# EAGLE design Brain1portB (EAGLE 9.4.1)

## Sheet 1 of 2
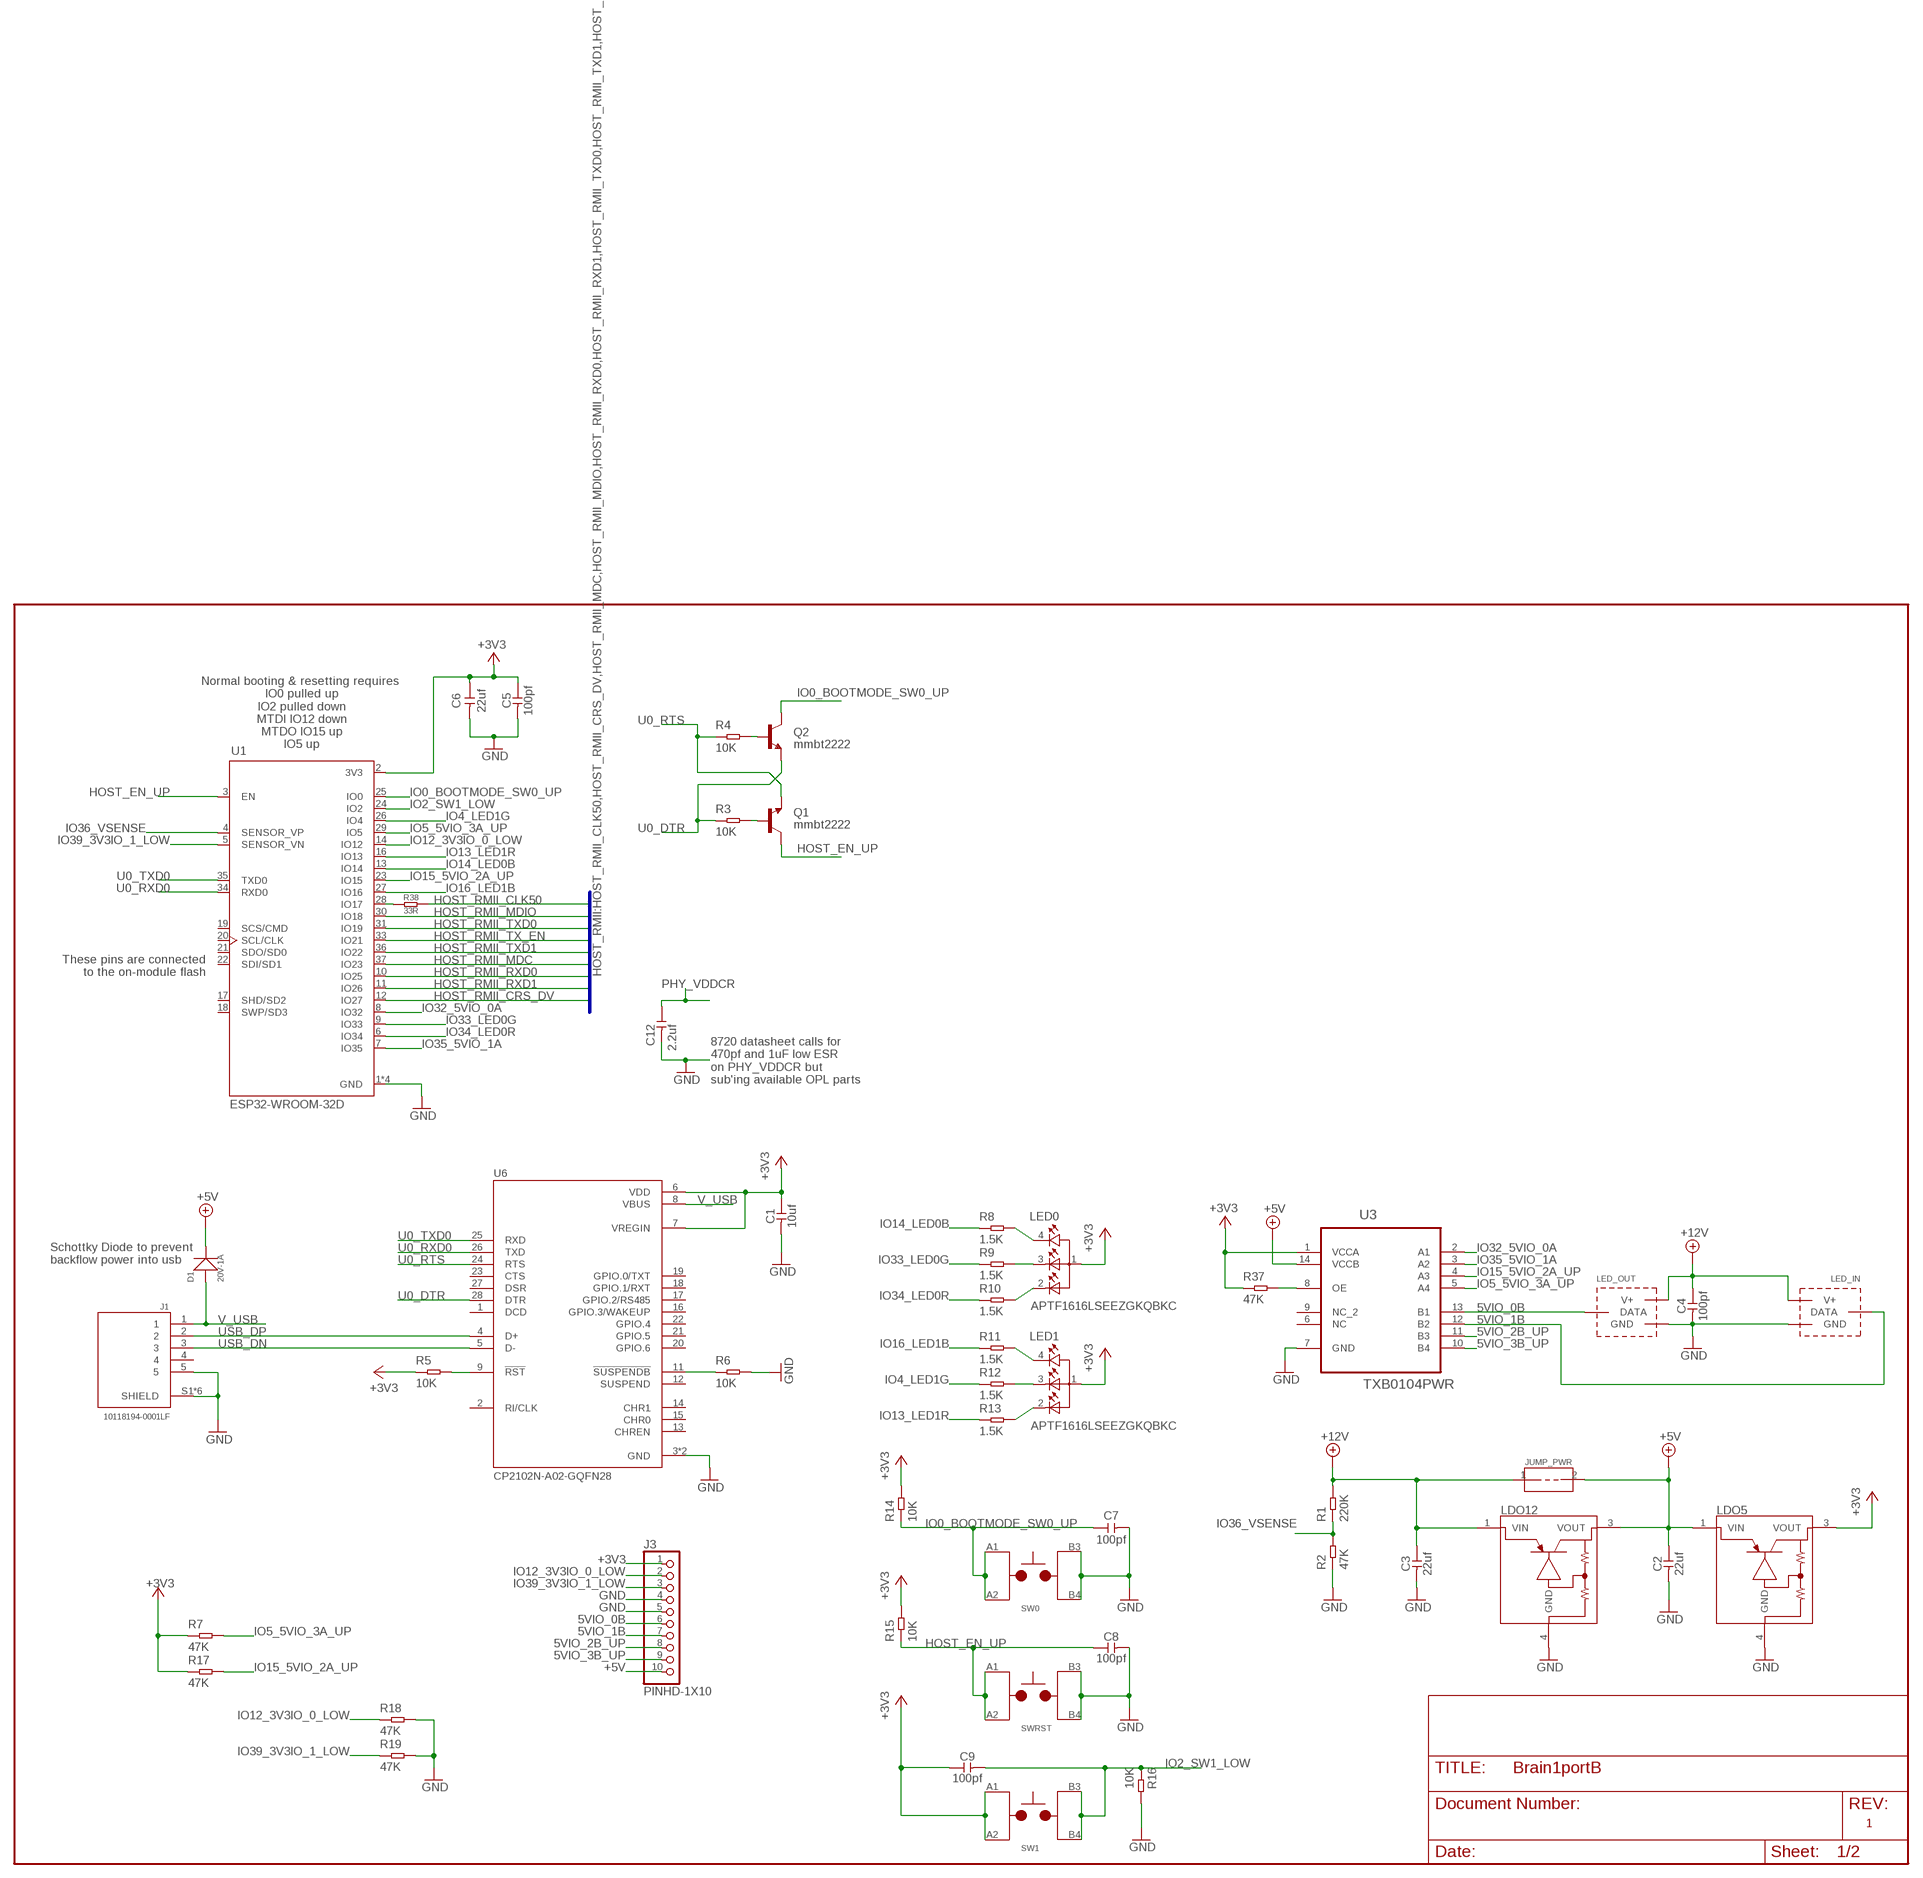
[diagram p0: schematic, sheet 1]

### Parts
C1  10uf  CERAMIC-10UF-6.3V-20%-X5R(0402)  [C0402]
C2  22uf  CERAMIC-22UF-6.3V-20%-X5R(0805)  [C0805]
C3  22uf  CERAMIC-22UF-6.3V-20%-X5R(0805)  [C0805]
C4  100pf  CERAMIC-100PF-50V-5%-NPO(0402)  [C0402]
C5  100pf  CERAMIC-100PF-50V-5%-NPO(0402)  [C0402]
C6  22uf  CERAMIC-22UF-6.3V-20%-X5R(0805)  [C0805]
C7  100pf  CERAMIC-100PF-50V-5%-NPO(0402)  [C0402]
C8  100pf  CERAMIC-100PF-50V-5%-NPO(0402)  [C0402]
C9  100pf  CERAMIC-100PF-50V-5%-NPO(0402)  [C0402]
C12  2.2uf  CERAMIC-2.2UF-10V-10%-X7R(0603)  [C0603]
D1  20V-1A  SMD-DIODE-SCHOTTKY-20V-1A(SOD-123)  [SOD-123]
J1  10118194-0001LF  [AMPHENOL_10118194-0001LF]
J3  PINHD-1X10  [1X10-BIG]
JUMP_PWR  PWR_SUPPLY_SHORT050_DRILLED  [SHORT_050_DRILLED]
LDO5  NCP5501DPAK3  [TO229P990X238-3]
LDO12  NCP5501DPAK3  [TO229P990X238-3]
LED0  APTF1616LSEEZGKQBKC  [LEDSC160X160X070-4N]
LED1  APTF1616LSEEZGKQBKC  [LEDSC160X160X070-4N]
LED_IN  3WAY_LED_CONWIRES  [3WAY_LED_WIRES]
LED_OUT  3WAY_LED_CONWIRES  [3WAY_LED_WIRES]
Q1  mmbt2222  MMBT2222ALT1-NPN-SOT23-BEC  [SOT23-BEC]
Q2  mmbt2222  MMBT2222ALT1-NPN-SOT23-BEC  [SOT23-BEC]
R1  220K  SMD-RES-220K-5%-1/16W(0402)  [R0402]
R2  47K  SMD-RES-47K-5%-1/16W(0402)  [R0402]
R3  10K  SMD-RES-10K-5%-1/(0402)  [R0402]
R4  10K  SMD-RES-10K-5%-1/(0402)  [R0402]
R5  10K  SMD-RES-10K-5%-1/(0402)  [R0402]
R6  10K  SMD-RES-10K-5%-1/(0402)  [R0402]
R7  47K  SMD-RES-47K-5%-1/16W(0402)  [R0402]
R8  1.5K  SMD-RES-1.5K-5%-1/16W(0402)  [R0402]
R9  1.5K  SMD-RES-1.5K-5%-1/16W(0402)  [R0402]
R10  1.5K  SMD-RES-1.5K-5%-1/16W(0402)  [R0402]
R11  1.5K  SMD-RES-1.5K-5%-1/16W(0402)  [R0402]
R12  1.5K  SMD-RES-1.5K-5%-1/16W(0402)  [R0402]
R13  1.5K  SMD-RES-1.5K-5%-1/16W(0402)  [R0402]
R14  10K  SMD-RES-10K-5%-1/(0402)  [R0402]
R15  10K  SMD-RES-10K-5%-1/(0402)  [R0402]
R16  10K  SMD-RES-10K-5%-1/(0402)  [R0402]
R17  47K  SMD-RES-47K-5%-1/16W(0402)  [R0402]
R18  47K  SMD-RES-47K-5%-1/16W(0402)  [R0402]
R19  47K  SMD-RES-47K-5%-1/16W(0402)  [R0402]
R37  47K  SMD-RES-47K-5%-1/16W(0402)  [R0402]
R38  33R  SMD-RES-33R-5%-1/10W(0603)  [R0603]
SW0  TL3301T3301SWITCH  [SW-4]
SW1  TL3301T3301SWITCH  [SW-4]
SWRST  TL3301T3301SWITCH  [SW-4]
U1  ESP32-WROOM-32D  [MODULE_ESP32-WROOM-32D]
U3  TXB0104PWR  [SOP65P640X120-14N]
U6  CP2102N-A02-GQFN28  CP2102N-A01-GQFN28  [QFN50P500X500X80-29N]

### Nets
5VIO_0B: J3.6 LED_OUT.DATA U3.13(B1)
5VIO_1B: J3.7 LED_IN.DATA U3.12(B2)
5VIO_2B_UP: J3.8 U3.11(B3)
5VIO_3B_UP: J3.9 U3.10(B4)
+3V3: C1.1 C5.1 C6.1 C9.1 J3.1 LDO5.3(VOUT) LED0.1 LED1.1 R5.1 R7.1 R14.2 R15.2 R17.1 R37.1 SW1.A1 SW1.A2 U1.2(3V3) U3.1(VCCA) U6.6(VDD) U6.7(VREGIN) ; also sheet 2
+5V [power]: C2.1 D1.- J3.10 JUMP_PWR.2 LDO5.1(VIN) LDO12.3(VOUT) U3.14(VCCB)
+12V [power]: C3.1 C4.1 JUMP_PWR.1 LDO12.1(VIN) LED_IN.V+ LED_OUT.V+ R1.2
GND [power]: C1.2 C2.2 C3.2 C4.2 C5.2 C6.2 C7.2 C8.2 C12.2 J1.5 J1.S1(SHIELD) J1.S2(SHIELD) J1.S3(SHIELD) J1.S4(SHIELD) J1.S5(SHIELD) J1.S6(SHIELD) J3.4 J3.5 LDO5.4(GND) LDO12.4(GND) LED_IN.GND LED_OUT.GND R2.1 R6.2 R16.2 R18.2 R19.2 SW0.B3 SW0.B4 SWRST.B3 SWRST.B4 U1.1(GND) U1.15(GND) U1.38(GND) U1.39(GND) U3.7(GND) U6.3(GND) U6.29(GND) ; also sheet 2
HOST_EN_UP: C8.1 Q1.C R15.1 SWRST.A1 SWRST.A2 U1.3(EN)
HOST_RMII_CLK50 [Ethernet]: R38.2 ; also sheet 2
HOST_RMII_CRS_DV [Ethernet]: U1.12(IO27) ; also sheet 2
HOST_RMII_MDC [Serial]: U1.37(IO23) ; also sheet 2
HOST_RMII_MDIO [Serial]: U1.30(IO18) ; also sheet 2
HOST_RMII_RXD0 [Ethernet]: U1.10(IO25) ; also sheet 2
HOST_RMII_RXD1 [Ethernet]: U1.11(IO26) ; also sheet 2
HOST_RMII_TX_EN [Ethernet]: U1.33(IO21) ; also sheet 2
HOST_RMII_TXD0 [Ethernet]: U1.31(IO19) ; also sheet 2
HOST_RMII_TXD1 [Ethernet]: U1.36(IO22) ; also sheet 2
IO0_BOOTMODE_SW0_UP: C7.1 Q2.C R14.1 SW0.A1 SW0.A2 U1.25(IO0)
IO2_SW1_LOW: C9.2 R16.1 SW1.B3 SW1.B4 U1.24(IO2)
IO4_LED1G: R12.1 U1.26(IO4)
IO5_5VIO_3A_UP: R7.2 U1.29(IO5) U3.5(A4)
IO12_3V3IO_0_LOW: J3.2 R18.1 U1.14(IO12)
IO13_LED1R: R13.1 U1.16(IO13)
IO14_LED0B: R8.1 U1.13(IO14)
IO15_5VIO_2A_UP: R17.2 U1.23(IO15) U3.4(A3)
IO16_LED1B: R11.1 U1.27(IO16)
IO32_5VIO_0A: U1.8(IO32) U3.2(A1)
IO33_LED0G: R9.1 U1.9(IO33)
IO34_LED0R: R10.1 U1.6(IO34)
IO35_5VIO_1A: U1.7(IO35) U3.3(A2)
IO36_VSENSE: R1.1 R2.2 U1.4(SENSOR_VP)
IO39_3V3IO_1_LOW: J3.3 R19.1 U1.5(SENSOR_VN)
N$1: R38.1 U1.28(IO17)
N$5: R5.2 U6.9(!RST)
N$6: R6.1 U6.11(!SUSPENDB)
N$7: Q1.B R3.2
N$8: Q2.B R4.2
N$9: LED0.4 R8.2
N$10: LED0.3 R9.2
N$11: LED0.2 R10.2
N$14: LED1.4 R11.2
N$15: LED1.3 R12.2
N$16: LED1.2 R13.2
N$27: R37.2 U3.8(OE)
PHY_VDDCR: C12.1 ; also sheet 2
U0_DTR: Q2.E R3.1 U6.28(DTR)
U0_RTS: Q1.E R4.1 U6.24(RTS)
U0_RXD0 [Serial]: U1.34(RXD0) U6.26(TXD)
U0_TXD0 [Serial]: U1.35(TXD0) U6.25(RXD)
USB_DN [Serial]: J1.3 U6.5(D-)
USB_DP [Serial]: J1.2 U6.4(D+)
V_USB [power]: D1.+ J1.1 U6.8(VBUS)
Unconnected: J1.4 U1.17(SHD/SD2) U1.18(SWP/SD3) U1.19(SCS/CMD) U1.20(SCL/CLK) U1.21(SDO/SD0) U1.22(SDI/SD1) U3.6(NC) U3.9(NC_2) U6.1(DCD) U6.2(RI/CLK) U6.12(SUSPEND) U6.13(CHREN) U6.14(CHR1) U6.15(CHR0) U6.16(GPIO.3/WAKEUP) U6.17(GPIO.2/RS485) U6.18(GPIO.1/RXT) U6.19(GPIO.0/TXT) U6.20(GPIO.6) U6.21(GPIO.5) U6.22(GPIO.4) U6.23(CTS) U6.27(DSR)

### Buses
HOST_RMII:HOST_RMII_CLK50,HOST_RMII_CRS_DV,HOST_RMII_MDC,HOST_RMII_MDIO,HOST_RMII_RXD0,HOST_RMII_RXD1,HOST_RMII_TXD0,HOST_RMII_TXD1,HOST_RMII_TX_EN

### Notes on the sheet
- Normal booting & resetting requires 
  IO0 pulled up
  IO2 pulled down
  MTDI IO12 down
  MTDO IO15 up
  IO5 up
- These pins are connected
  to the on-module flash
- 8720 datasheet calls for 
  470pf and 1uF low ESR 
  on PHY_VDDCR but
  sub'ing available OPL parts
- Schottky Diode to prevent
  backflow power into usb
- 1

## Sheet 2 of 2
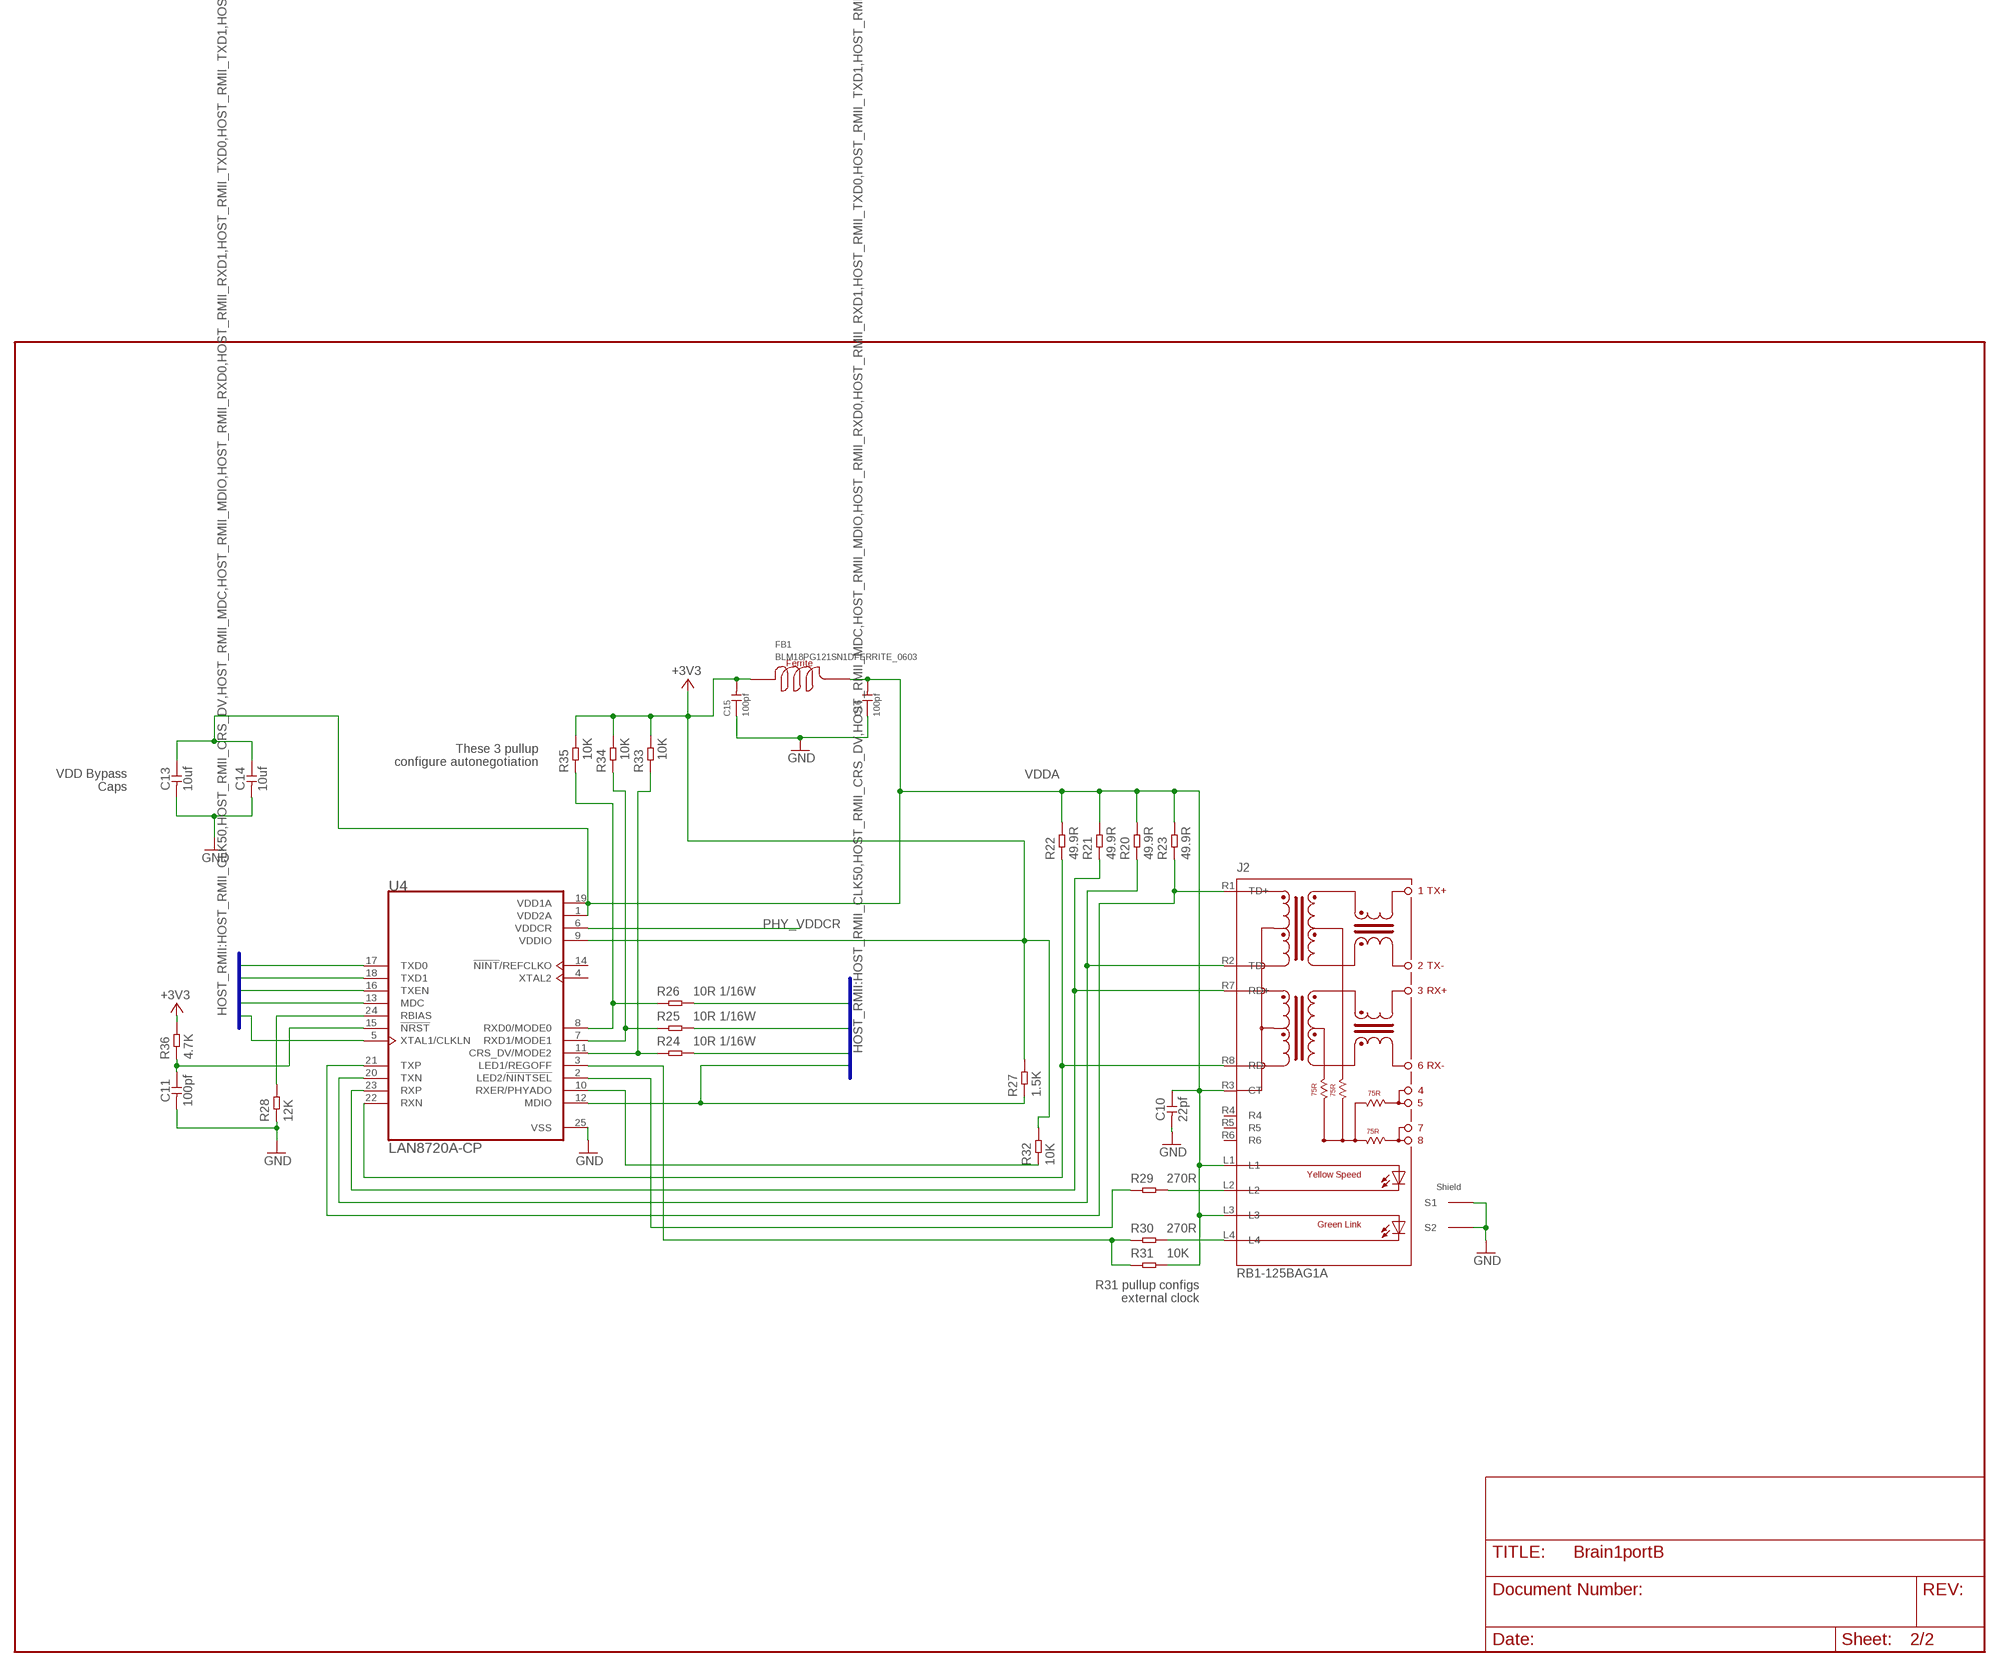
[diagram p1: schematic, sheet 2]

### Parts
C10  22pf  CERAMIC-22PF-50V-5%-NPO(0402)  [C0402]
C11  100pf  CERAMIC-100PF-50V-5%-NPO(0402)  [C0402]
C13  10uf  CERAMIC-10UF-6.3V-20%-X5R(0402)  [C0402]
C14  10uf  CERAMIC-10UF-6.3V-20%-X5R(0402)  [C0402]
C15  100pf  CERAMIC-100PF-50V-5%-NPO(0402)  [C0402]
C16  100pf  CERAMIC-100PF-50V-5%-NPO(0402)  [C0402]
FB1  BLM18PG121SN1DFERRITE_0603  [L0603]
J2  RB1-125BAG1A  [WIZNET_RB1-125BAG1A]
R20  49.9R  SMD-RES-49.9R-1%-1/16W(0402)  [R0402]
R21  49.9R  SMD-RES-49.9R-1%-1/16W(0402)  [R0402]
R22  49.9R  SMD-RES-49.9R-1%-1/16W(0402)  [R0402]
R23  49.9R  SMD-RES-49.9R-1%-1/16W(0402)  [R0402]
R24  10R 1/16W  SMD-RES-10R-5%-1/16W(0402)  [R0402]
R25  10R 1/16W  SMD-RES-10R-5%-1/16W(0402)  [R0402]
R26  10R 1/16W  SMD-RES-10R-5%-1/16W(0402)  [R0402]
R27  1.5K  SMD-RES-1.5K-5%-1/16W(0402)  [R0402]
R28  12K  SMD-RES-12K-1%-1/16W(0402)  [R0402]
R29  270R  SMD-RES-270R-1%-1/16W(0402)  [R0402]
R30  270R  SMD-RES-270R-1%-1/16W(0402)  [R0402]
R31  10K  SMD-RES-10K-5%-1/(0402)  [R0402]
R32  10K  SMD-RES-10K-5%-1/(0402)  [R0402]
R33  10K  SMD-RES-10K-5%-1/(0402)  [R0402]
R34  10K  SMD-RES-10K-5%-1/(0402)  [R0402]
R35  10K  SMD-RES-10K-5%-1/(0402)  [R0402]
R36  4.7K  SMD-RES-4.7K-5%-1/16W(0402)  [R0402]
U4  LAN8720A-CP  [QFN50P400X400X100-25N]

### Nets
+3V3: C15.2 FB1.1 R27.2 R32.2 R33.2 R34.2 R35.2 R36.2 U4.9(VDDIO) ; also sheet 1
GND [power]: C10.2 C11.2 C13.2 C14.2 C15.1 C16.1 J2.S1 J2.S2 R28.1 U4.25(VSS) ; also sheet 1
HOST_RMII_CLK50 [Ethernet]: U4.5(XTAL1/CLKLN) ; also sheet 1
HOST_RMII_CRS_DV [Ethernet]: R24.2 ; also sheet 1
HOST_RMII_MDC [Serial]: U4.13(MDC) ; also sheet 1
HOST_RMII_MDIO [Serial]: R27.1 U4.12(MDIO) ; also sheet 1
HOST_RMII_RXD0 [Ethernet]: R26.2 ; also sheet 1
HOST_RMII_RXD1 [Ethernet]: R25.2 ; also sheet 1
HOST_RMII_TX_EN [Ethernet]: U4.16(TXEN) ; also sheet 1
HOST_RMII_TXD0 [Ethernet]: U4.17(TXD0) ; also sheet 1
HOST_RMII_TXD1 [Ethernet]: U4.18(TXD1) ; also sheet 1
N$12: J2.R8(RD-) R22.1 U4.22(RXN)
N$13: J2.R7(RD+) R21.1 U4.23(RXP)
N$17: J2.R2(TD-) R20.1 U4.20(TXN)
N$18: R24.1 R33.1 U4.11(CRS_DV/MODE2)
N$19: J2.R1(TD+) R23.1 U4.21(TXP)
N$20: R25.1 R34.1 U4.7(RXD1/MODE1)
N$21: R26.1 R35.1 U4.8(RXD0/MODE0)
N$22: R28.2 U4.24(RBIAS)
N$23: R30.1 R31.1 U4.3(LED1/REGOFF)
N$24: R29.1 U4.2(LED2/!NINTSEL!)
N$25: J2.L2 R29.2
N$26: J2.L4 R30.2
N$28: C11.1 R36.1 U4.15(!NRST)
N$29: R32.1 U4.10(RXER/PHYADO)
PHY_VDDCR: U4.6(VDDCR) ; also sheet 1
VDDA: C10.1 C13.1 C14.1 C16.2 FB1.2 J2.L1 J2.L3 J2.R3(CT) R20.2 R21.2 R22.2 R23.2 R31.2 U4.1(VDD2A) U4.19(VDD1A)
Unconnected: J2.R4 J2.R5 J2.R6 U4.4(XTAL2) U4.14(!NINT!/REFCLKO)

### Buses
HOST_RMII:HOST_RMII_CLK50,HOST_RMII_CRS_DV,HOST_RMII_MDC,HOST_RMII_MDIO,HOST_RMII_RXD0,HOST_RMII_RXD1,HOST_RMII_TXD0,HOST_RMII_TXD1,HOST_RMII_TX_EN

### Notes on the sheet
- These 3 pullup
  configure autonegotiation
- VDD Bypass
  Caps
- R31 pullup configs
  external clock

## Library data of the parts
C1 C13 C14 = OPL_Capacitor:CERAMIC-10UF-6.3V-20%-X5R(0402): 302010053; MPN: CC0402MRX5R5BB106
C2 C3 C6 = OPL_Capacitor:CERAMIC-22UF-6.3V-20%-X5R(0805): 302010171; MPN: CC0805MKX5R5BB226
C4 C5 C7-C9 C11 C15 C16 = OPL_Capacitor:CERAMIC-100PF-50V-5%-NPO(0402): 302010012; MPN: CC0402JRNPO9BN101
C10 = OPL_Capacitor:CERAMIC-22PF-50V-5%-NPO(0402): 302010018; MPN: CC0402JRNPO9BN220
C12 = OPL_Capacitor:CERAMIC-2.2UF-10V-10%-X7R(0603): 302010054; MPN: CC0603KRX7R6BB225
D1 = OPL_Discrete_Semiconductor:SMD-DIODE-SCHOTTKY-20V-1A(SOD-123): 304020034; MPN: B5819W
FB1 = TomSeago:BLM18PG121SN1D
J1 = 10118194-0001LF:10118194-0001LF: Micro Usb, 2.0 Type b, Rcpt, Smt; DESCRIPTION: Micro Usb, 2.0 Type b, Rcpt, Smt; DIGI-KEY_PART_NUMBER: 609-4618-1-ND; DIGI-KEY_PURCHASE_URL: https://www.digikey.com/product-detail/en/amphenol-icc-fci/10118194-0001LF/609-4618-1-ND/2785382?utm_source=snapeda&utm_medium=aggregator&utm_campaign=symbol; MF: Amphenol ICC; MP: 10118194-0001LF; PACKAGE: None
J2 = TomSeago:RB1-125BAG1A: Wiznet RB1-125BAG1A RJ45 1x1 Tab Down Through Hole
J3 = adafruit:PINHD-1X10: Pin header 1x10 0.1" spacing With round pins
JUMP_PWR = TomSeago:PWR_SUPPLY_SHORT
LDO5 LDO12 = TomSeago:NCP5501
LED0 LED1 = APTF1616LSEEZGKQBKC:APTF1616LSEEZGKQBKC: HELI Colour; 1.6X1.6MM LOW CURRENT RGB SMD LED; AVAILABILITY: Unavailable; DESCRIPTION: HELI Colour; 1.6X1.6MM LOW CURRENT RGB SMD LED; MF: Kingbright; MP: APTF1616LSEEZGKQBKC; PACKAGE: 0606 Kingbright; PRICE: None
LED_IN LED_OUT = TomSeago:3WAY_LED_CON
Q1 Q2 = transistor:*-NPN-: NPN Transistror BF959 corrected 2008.03.06
R1 = OPL_Resistor:SMD-RES-220K-5%-1/16W(0402): 301012019; MPN: RC0402JR-070RL; VALUE: 0R
R2 R7 R17-R19 R37 = OPL_Resistor:SMD-RES-47K-5%-1/16W(0402): 301010005; MPN: RC0402JR-0747KL
R3-R6 R14-R16 R31-R35 = OPL_Resistor:SMD-RES-10K-5%-1/(0402): 301010004; MPN: RC0402JR-0710KL
R8-R13 R27 = OPL_Resistor:SMD-RES-1.5K-5%-1/16W(0402): 301012015; MPN: RC0402JR-071K5L
R20-R23 = OPL_Resistor:SMD-RES-49.9R-1%-1/16W(0402): 301012002; MPN: RC0402FR-0749R9L
R24-R26 = OPL_Resistor:SMD-RES-10R-5%-1/16W(0402): 301010075; MPN: RC0402JR-0710RL
R28 = OPL_Resistor:SMD-RES-12K-1%-1/16W(0402): 301011982; MPN: RC0402JR-070RL; VALUE: 0R
R29 R30 = OPL_Resistor:SMD-RES-270R-1%-1/16W(0402): 301011992; MPN: RC0402JR-070RL; VALUE: 0R
R36 = OPL_Resistor:SMD-RES-4.7K-5%-1/16W(0402): 301012026; MPN: RC0402JR-074K7L
R38 = OPL_Resistor:SMD-RES-33R-5%-1/10W(0603): 301012124; MPN: RC0603FR-071K5L; VALUE: 1.5K
SW0 SW1 SWRST = TomSeago:TL3301
U1 = ESP32-WROOM-32D:ESP32-WROOM-32D: IC: SoC; GPIO, I2C, I2S, IR, SD, SDIO, SPI, UART; 2.7÷3.6VDC; 20dBm; DESCRIPTION: IC: SoC; GPIO, I2C, I2S, IR, SD, SDIO, SPI, UART; 2.7÷3.6VDC; 20dBm; DIGI-KEY_PART_NUMBER: 1904-1023-1-ND; DIGI-KEY_PURCHASE_URL: https://www.digikey.com/product-detail/en/espressif-systems/ESP32-WROOM-32D/1904-1023-1-ND/9381732?utm_source=snapeda&utm_medium=aggregator&utm_campaign=symbol; MF: Espressif Systems; MP: ESP32-WROOM-32D; PACKAGE: Module Espressif Systems
U3 = TXB0104PWR:TXB0104PWR: 4-BIT BIDIRECTIONAL VOLTAGE-LEVEL TRANSLATOR; AVAILABILITY: Unavailable; DESCRIPTION: 4-Bit Bidirectional Voltage-Level Shifter with Auto Direction Sensing and +/-15 kV ESD Protect 14-TSSOP -40 to 85; MF: Texas Instruments; MP: TXB0104PWR; PACKAGE: TSSOP-14 Texas Instruments; PRICE: None
U4 = LAN8720A-CP:LAN8720A-CP: LAN8720A Series 3.3 V RMII 10/100 Ethernet Transceiver Surface Mount - QFN-24; DESCRIPTION: LAN8720A Series 3.3 V RMII 10/100 Ethernet Transceiver Surface Mount - QFN-24; DIGI-KEY_PART_NUMBER: 638-1080-ND; DIGI-KEY_PURCHASE_URL: https://www.digikey.com/product-detail/en/microchip-technology/LAN8720A-CP/638-1080-ND/2051556?utm_source=snapeda&utm_medium=aggregator&utm_campaign=symbol; MF: Microchip; MP: LAN8720A-CP; PACKAGE: QFN-24 Microchip
U6 = CP2102N-A01-GQFN28:CP2102N-A01-GQFN28: Ic Bridge Usb To Uart 28qfn; AVAILABILITY: Unavailable; DESCRIPTION: Usb-Uart Interface Bridge, Qfn-28; MF: Silicon Labs; MP: CP2102N-A01-GQFN28; PACKAGE: QFN-28 Silicon Labs; PRICE: None

## Net classes
0 default: width 0.203 mm, clearance 0.203 mm
1 power: width 0.406 mm, clearance 0.203 mm
2 Ethernet: width 0.203 mm, clearance 0.203 mm
3 Serial: width 0.203 mm, clearance 0.203 mm

## Board
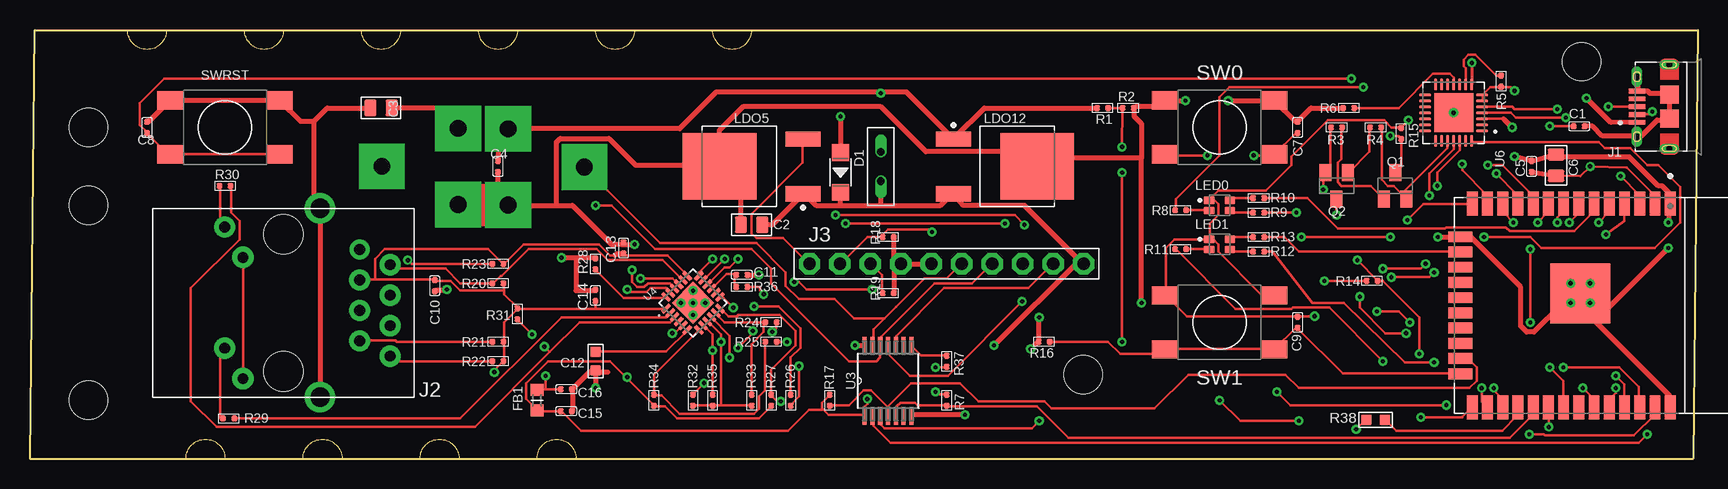
[diagram p2: board, top side]
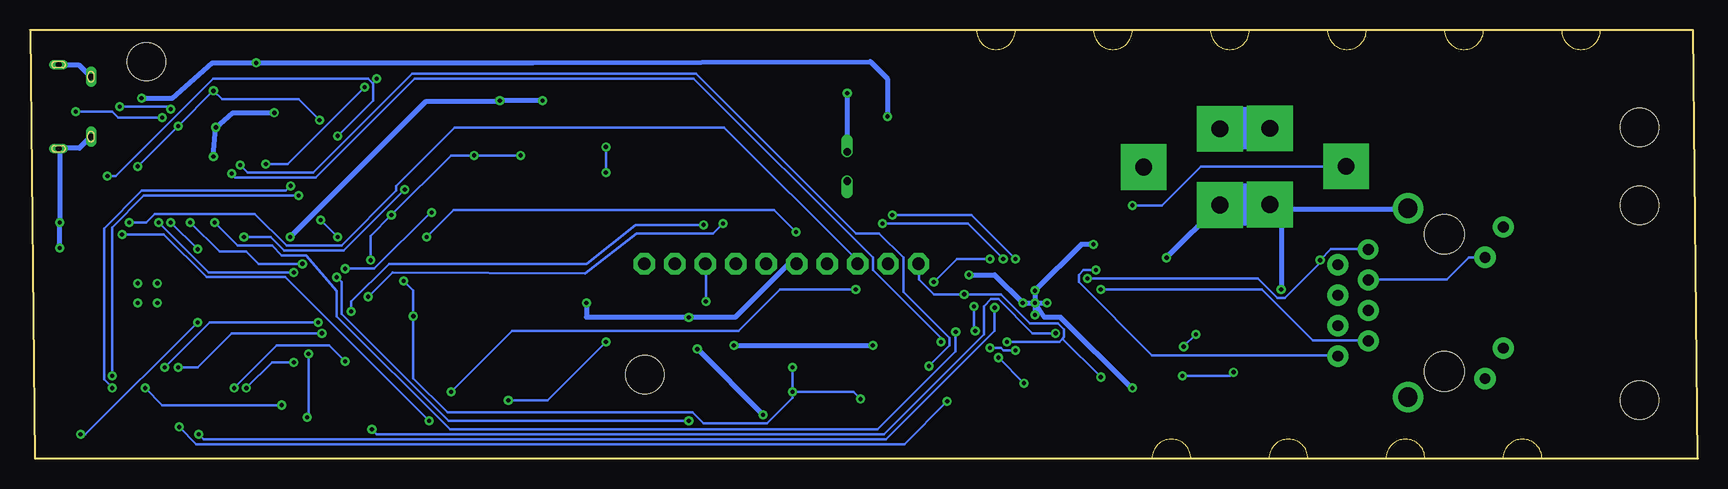
[diagram p3: board, bottom side, seen from below]

Size 139.04 x 35.76 mm. Coordinates in mm from the lower left corner, seen from the top.
Outline: 0,0 0.41,35.76 139.04,35.76 138.63,0 0,0
Copper layers (1*16): Top 0.035mm / dielectric 1.5mm / Bottom 0.035mm
Design rules "default *": minimum track width 8mil, minimum drill 0.35mm, track to track 6mil, track to pad 6mil, pad to pad 6mil, via to via 6mil, smd to smd 6mil, copper to edge 40mil, drill to drill 18mil, minimum pad ring 6mil, minimum via ring 8mil, stop-mask expansion 4mil, vias tented up to drill 0mil, thermal gap 10mil
Holes 3.17 mm at 4.88,4.88 4.88,21.13 129.34,33.12 4.88,27.64 87.78,7.01
tRestrict: area 0,0 to 8.9,22.9
Milling: 10 lines

### Footprints (pad centres in the part's own frame; a part is rotated, then mirrored left to right if it is on the bottom)
C0402 = smd 0.5 x 0.5: 1 0,0.463; 2 0,-0.463
C0805 = smd 1.397 x 1.016: 1 0,0.889; 2 0,-0.889
C0603 = smd 0.889 x 0.889: 1 0,0.762; 2 0,-0.762
SOD-123 = smd 1.397 x 1.397: + -1.651,0; - 1.651,0
L0603 = smd 1 x 1.1: 1 -0.85,0; 2 0.85,0
AMPHENOL_10118194-0001LF = smd 0.4 x 1.35: 1 -1.3,2.7; 2 -0.65,2.7; 3 0,2.7; 4 0.65,2.7; 5 1.3,2.7 | drill 0.55 pad 0.65 long: S1 -2.5,2.7; S2 2.5,2.7 | drill 0.5 pad 0.775 long: S3 -3.5,0; S6 3.5,0 | smd 1.5 x 1.55: S4 -1,0; S5 1,0
WIZNET_RB1-125BAG1A = drill 0.9 pad 1.778: L1 6.325,-3.38; L2 3.784,-4.899; L3 -3.786,-3.379; L4 -6.325,-4.9; R2 -3.176,8.889; R3 -1.906,6.349; R4 -0.636,8.889; R5 0.634,6.349; R6 1.904,8.889; R7 3.174,6.349; R8 4.444,8.889 | drill 0.9 pad 1.7: R1 -4.446,6.349 | drill 1.6 pad 2.54: S1 -7.876,3.049; S2 7.874,3.049 | hole 3.3: 5.714,-0.001; -5.716,-0.001
1X10-BIG = drill 1.016 pad 1.778 octagon: 1 -11.43,0; 2 -8.89,0; 3 -6.35,0; 4 -3.81,0; 5 -1.27,0; 6 1.27,0; 7 3.81,0; 8 6.35,0; 9 8.89,0; 10 11.43,0
SHORT_050_DRILLED = drill 0.65 offset: 1 -1.219,0; 2 1.219,0
TO229P990X238-3 = smd 2.934 x 1.256: 1 -4.291,2.29; 3 -4.291,-2.29 | smd 6.154 x 5.567: 4 2.681,0
LEDSC160X160X070-4N = smd 0.89 x 0.64: 1 -0.87,0.425; 2 0.87,0.425; 3 0.87,-0.425; 4 -0.87,-0.425
3WAY_LED_WIRES = drill 1.4 pad 3.81 square: DATA -3.175,0; GND 3.175,-3.175; V+ 3.175,3.175
SOT23-BEC = smd 1 x 1.4: B -0.95,-1.1; C 0,1.1; E 0.95,-1.1
R0402 = smd 0.5 x 0.5: 1 0,0.463; 2 0,-0.463
R0603 = smd 0.889 x 0.889: 1 0,0.762; 2 0,-0.762
SW-4 = smd 2.212 x 1.512: A1 -4.55,-2.25; A2 4.55,-2.25; B3 -4.55,2.25; B4 4.55,2.25
MODULE_ESP32-WROOM-32D = smd 2 x 0.9: 1 -8.5,5.26; 2 -8.5,3.99; 3 -8.5,2.72; 4 -8.5,1.45; 5 -8.5,0.18; 6 -8.5,-1.09; 7 -8.5,-2.36; 8 -8.5,-3.63; 9 -8.5,-4.9; 10 -8.5,-6.17; 11 -8.5,-7.44; 12 -8.5,-8.71; 13 -8.5,-9.98; 14 -8.5,-11.25; 25 8.5,-11.25; 26 8.5,-9.98; 27 8.5,-8.71; 28 8.5,-7.44; 29 8.5,-6.17; 30 8.5,-4.9; 31 8.5,-3.63; 32 8.5,-2.36; 33 8.5,-1.09; 34 8.5,0.18; 35 8.5,1.45; 36 8.5,2.72; 37 8.5,3.99; 38 8.5,5.26 | smd 0.9 x 2: 15 -5.715,-12.25; 16 -4.445,-12.25; 17 -3.175,-12.25; 18 -1.905,-12.25; 19 -0.635,-12.25; 20 0.635,-12.25; 21 1.905,-12.25; 22 3.175,-12.25; 23 4.445,-12.25; 24 5.715,-12.25 | smd 5 x 5: 39 -1,-2.24
SOP65P640X120-14N = smd 1.473 x 0.356: 1 -2.921,1.956; 2 -2.921,1.295; 3 -2.921,0.66; 4 -2.921,0; 5 -2.921,-0.66; 6 -2.921,-1.295; 7 -2.921,-1.956; 8 2.921,-1.956; 9 2.921,-1.295; 10 2.921,-0.66; 11 2.921,0; 12 2.921,0.66; 13 2.921,1.295; 14 2.921,1.956
QFN50P400X400X100-25N = smd 0.86 x 0.26: 1 -1.935,1.25; 2 -1.935,0.75; 3 -1.935,0.25; 4 -1.935,-0.25; 5 -1.935,-0.75; 6 -1.935,-1.25; 13 1.935,-1.25; 14 1.935,-0.75; 15 1.935,-0.25; 16 1.935,0.25; 17 1.935,0.75; 18 1.935,1.25 | smd 0.26 x 0.86: 7 -1.25,-1.935; 8 -0.75,-1.935; 9 -0.25,-1.935; 10 0.25,-1.935; 11 0.75,-1.935; 12 1.25,-1.935; 19 1.25,1.935; 20 0.75,1.935; 21 0.25,1.935; 22 -0.25,1.935; 23 -0.75,1.935; 24 -1.25,1.935 | smd 2.5 x 2.5: 25 0,0
QFN50P500X500X80-29N = smd 1.01 x 0.27: 1 -2.36,1.5; 2 -2.36,1; 3 -2.36,0.5; 4 -2.36,0; 5 -2.36,-0.5; 6 -2.36,-1; 7 -2.36,-1.5; 15 2.36,-1.5; 16 2.36,-1; 17 2.36,-0.5; 18 2.36,0; 19 2.36,0.5; 20 2.36,1; 21 2.36,1.5 | smd 0.27 x 1.01: 8 -1.5,-2.36; 9 -1,-2.36; 10 -0.5,-2.36; 11 0,-2.36; 12 0.5,-2.36; 13 1,-2.36; 14 1.5,-2.36; 22 1.5,2.36; 23 1,2.36; 24 0.5,2.36; 25 0,2.36; 26 -0.5,2.36; 27 -1,2.36; 28 -1.5,2.36 | smd 3.25 x 3.25: 29 0,0

### Placement (x,y rotation side)
C1  129.13,27.74 90 top
C2  60.15,19.51 270 top
C3  29.26,29.26 270 top
C4  39.01,24.38 0 top
C5  125.17,24.38 180 top
C6  127.2,24.49 180 top
C7  105.66,27.64 180 top
C8  9.75,27.64 180 top
C9  105.66,11.38 0 top
C10  33.73,14.43 0 top
C11  59.33,15.34 90 top
C12  47.14,8.13 0 top
C13  49.48,17.58 180 top
C14  47.14,13.61 180 top
C15  44.7,3.96 270 top
C16  44.7,5.79 270 top
D1  67.56,23.88 270 top
FB1  42.27,4.88 90 top
J1  136.65,29.36 90 top
J2  21.13,13 270 top
J3  76.4,16.26 0 top
JUMP_PWR  70.92,24.38 270 top
LDO5  60.15,24.38 180 top
LDO12  81.28,24.38 0 top
LED0  99.16,21.13 0 top
LED1  99.16,17.88 0 top
LED_IN  32.51,24.38 0 top
LED_OUT  43.03,24.33 0 bottom
Q1  113.79,22.76 0 top
Q2  108.92,22.76 180 top
R1  89.41,29.26 270 top
R2  91.54,29.26 270 top
R3  108.92,27.64 90 top
R4  112.17,27.64 270 top
R5  122.63,31.5 180 top
R6  109.93,29.26 270 top
R7  76.4,4.88 0 top
R8  95.91,20.73 90 top
R9  102.41,20.52 270 top
R10  102.41,21.74 270 top
R11  95.91,17.48 90 top
R12  102.41,17.27 270 top
R13  102.41,18.49 270 top
R14  111.86,14.83 270 top
R15  114.3,27.13 180 top
R16  84.53,9.75 270 top
R17  66.65,4.88 0 top
R18  71.53,18.49 90 top
R19  71.53,13.82 90 top
R20  39.01,14.63 90 top
R21  39.01,9.75 90 top
R22  39.01,8.13 90 top
R23  39.01,16.26 90 top
R24  61.77,11.38 90 top
R25  61.77,9.75 90 top
R26  63.4,4.88 0 top
R27  61.77,4.88 0 top
R28  47.14,16.26 0 top
R29  16.56,3.35 270 top
R30  16.26,22.76 270 top
R31  40.64,12.09 180 top
R32  55.27,4.88 0 top
R33  60.15,4.88 0 top
R34  52.02,4.88 0 top
R35  56.9,4.88 0 top
R36  59.33,14.33 90 top
R37  76.4,8.13 180 top
R38  112.17,3.25 270 top
SW0  99.16,27.64 0 top
SW1  99.16,11.38 180 top
SWRST  16.26,27.64 0 top
U1  131.47,12.8 270 top
U3  71.53,6.5 90 top
U4  55.27,13 45 top
U6  118.67,28.85 180 top

### Tracks (layer width: path | path; a pad name or v marks a point on that pad's centre or on a via)
5VIO_0B
  Top 0.203: 71.22,11.68 70.31,10.77 70.31,9.45 U3.13 | J3.6 77.62,16.26 76.4,15.04 74.57,15.04 72.19,12.65 71.22,11.68 | 71.22,11.68 68.68,11.68 67.06,13.31 64.11,13.31 62.99,14.43 62.99,15.54 60.55,17.98 52.53,17.98 46.23,24.28 LED_OUT.DATA
5VIO_1B  (via drill 0.35)
  Top 0.203: J3.7 80.16,16.26 78.54,14.63 75.39,14.63 70.92,10.16 70.92,9.45 U3.12 70.87,8.43 70.56,8.13 68.28,8.13 61.77,14.63 61.77,15.85 60.15,17.48 52.12,17.48 48.46,21.13 v47.14,21.13
  Bottom 0.203: v47.14,21.13 44.7,21.13 41.45,24.38 LED_IN.DATA
5VIO_2B_UP  (via drill 0.35)
  Top 0.203: U3.11 71.53,8.74 73.36,6.91 76.5,6.91 v82.7,13.11
  Bottom 0.203: v82.7,13.11 82.7,16.26 J3.8
5VIO_3B_UP
  Top 0.203: U3.10 72.24,9.45 72.24,10.26 76.2,14.22 83.21,14.22 85.24,16.26 J3.9
+3V3  (via drill 0.35)
  Top 0.203: 56.9,4.47 55.27,4.47 R32.2 | 56.9,4.47 57.61,4.47 | 57.61,4.47 60.15,4.47 R33.2 | 56.9,4.47 R35.2 | 57.61,4.47 v57.61,9.75 57.61,10.36 56.49,11.48 U4.9 | v61.16,13.72 60.86,14.02 60.86,14.33 R36.2 | LDO5.3 64.41,26.62 64.41,24.69 60.15,20.42 60.15,18.8 60.55,18.39 62.79,18.39 64.92,16.26 J3.1 | v75.49,5.59 75.69,5.38 76.4,5.38 R7.1 | v75.49,7.62 76.4,7.62 R37.1 | 66.09,4.12 66.55,3.66 69.49,3.66 U3.1 69.6,3.66 69.6,4.37 69.8,4.57 v69.8,4.98 | 66.09,4.12 66.04,4.17 66.04,4.67 66.65,5.28 R17.1 | R27.2 61.77,4.37 60.76,3.35 53.95,3.35 52.93,4.37 52.02,4.37 R34.2 52.02,4.47 49.73,6.76 | 49.73,6.76 48.36,8.13 43.18,8.13 41.35,6.3 41.35,4.98 42.27,4.06 FB1.1 42.27,3.96 C15.2 44.3,3.96 45.92,2.34 63.2,2.34 64.92,4.06 66.04,4.06 66.09,4.12 | v49.78,6.81 49.73,6.76 | v126.69,27.74 C1.1 | U6.6 121.11,29.97 121.11,30.28 U6.7 121.11,30.38 121.72,30.99 122.63,30.99 | 114.3,27.64 113.49,27.64 112.88,28.25 108.2,28.25 105.16,25.2 105.16,24.49 103.02,22.35 99.06,22.35 98.35,21.64 LED0.1 98.55,21.74 99.06,21.23 99.06,20.32 98.35,19.61 98.35,18.39 LED1.1 | SW1.A1 103.63,13.72 102.62,13.72 99.06,17.27 99.06,17.88 98.55,18.39 98.45,18.39 LED1.1 | 114.3,27.64 v114.91,28.25 | 114.3,27.64 R15.2 | 105.66,11.89 96.42,11.89 94.69,13.61 SW1.A2 94.69,13.72 94.69,17.58 95.4,18.29 98.25,18.29 LED1.1 | R14.2 v107.9,14.83 | 105.66,11.89 v107.09,11.89 | 105.66,11.89 C9.1 | 135.43,21.23 U1.2 135.43,21.34 135.43,21.95 133.1,24.28 v130.05,24.38 129.24,23.57 C6.1 | 122.63,30.99 123.44,30.99 v123.75,30.68 | 122.63,30.99 R5.1
  Top 0.406: C5.1 C6.1
  Bottom 0.203: J3.1 64.92,16.26 64.92,14.94 63.7,13.72 v61.16,13.72 58.12,13.72 55.68,11.28 53.34,11.28 52.83,10.77 52.83,10.16 52.98,10.01 | v57.61,9.75 53.24,9.75 52.98,10.01 | v75.49,7.62 v75.49,5.59 | v75.49,5.59 70.41,5.59 v69.8,4.98 | v49.78,6.81 52.98,10.01 | v114.91,28.25 116.64,29.97 123.04,29.97 v123.75,30.68 v126.69,27.74 v130.05,24.38 | v107.9,14.83 107.09,14.02 v107.09,11.89 107.09,6.71 104.24,3.86 83.82,3.86 82.91,2.95 77.62,2.95 75.49,5.08 v75.49,5.59
+5V  (via drill 0.35)
  Top 0.406: C2.1 61.87,19.51 64.41,22.05 LDO5.1 64.62,22.05 65.53,21.13 67.56,21.13 | 67.56,21.13 70.92,21.13 | 70.92,21.13 75.89,21.13 76.81,22.05 76.91,22.05 LDO12.3 77.8,21.13 82.91,21.13 87.78,16.26 J3.10 87.38,16.46 v80.37,9.45 | v68.78,9.45 69.49,9.45 U3.14 | 67.56,21.13 D1.- | 70.92,21.13 JUMP_PWR.2
  Bottom 0.406: v80.37,9.45 v68.78,9.45
+12V  (via drill 0.35)
  Top 0.406: C4.1 39.01,26.62 39.83,27.43 LED_OUT.V+ 40.03,27.53 54.15,27.53 57.2,30.58 70.92,30.58 | C3.1 34.04,29.26 35.66,27.64 LED_IN.V+ | 70.92,30.58 73.08,30.58 LDO12.1 77.11,26.82 79.55,29.26 R1.2 | v70.92,30.48 70.92,30.58
  Bottom 0.406: v70.92,30.48 JUMP_PWR.1 | 39.8,27.56 LED_OUT.V+
  Bottom 3.556: LED_IN.V+ 39.8,27.56
GND  (via drill 0.35)
  Top 0.254: U6.3 122.83,28.35
  Top 0.406: 23.67,28.14 22.55,28.14 20.83,29.87 SWRST.B4 20.62,29.87 11.79,29.87 SWRST.B3 11.58,29.77 9.96,28.14 9.75,28.14 C8.2 | J2.S2 24.18,5.18 24.18,20.83 J2.S1 24.08,21.03 23.67,21.44 23.67,28.14 | v34.75,14.12 34.65,14.02 33.73,14.02 C10.2 | C2.2 59.23,19.51 59.23,22.66 57.51,24.38 LDO5.4 | C15.1 45.21,3.96 45.21,5.79 C16.1 45.31,5.89 46.74,7.32 47.14,7.32 C12.2 | v44.3,16.76 45.52,16.76 | 45.52,16.76 47.14,16.76 R28.1 | 43.89,21.13 39.93,21.13 LED_OUT.GND 39.83,21.34 39.01,22.15 C4.2 | 43.89,21.13 45.21,21.13 48.46,17.88 48.77,17.88 49.32,17.88 | 48.16,7.21 47.24,7.21 C12.2 | 43.89,21.13 43.89,26.42 44.2,26.72 48.26,26.72 50.49,24.49 57.3,24.49 LDO5.4 | LED_IN.GND 35.71,21.22 35.77,21.16 | J1.S2 134.01,31.8 134.01,30.68 J1.5 134.21,30.68 134.82,30.68 135.03,30.48 136.55,30.48 J1.S5 J1.S4 136.55,28.25 135.64,28.25 134.31,26.92 134.11,26.92 J1.S1 133.91,26.92 131.06,26.92 130.25,27.74 C1.2 | v136.55,19.71 136.65,19.81 136.65,21.23 U1.1 136.65,21.44 136.65,22.15 136.04,22.76 135.74,22.76 133.33,25.17 127.41,25.17 C6.2 125.17,24.79 C5.2 v123.75,25.2 | U1.39 129.13,13.82 128.12,13.82 127.61,13.31 127.61,12.8 125.37,10.57 124.77,10.57 124.26,11.07 124.26,14.33 120.09,18.49 119.28,18.49 U1.15 119.08,18.49 v117.35,18.49 | U1.38 136.65,4.37 136.65,5.28 129.24,12.7 129.24,13.61 U1.39 | v136.55,17.58 130.56,11.58 U1.39 | R19.2 72.03,13.82 72.03,15.75 72.54,16.26 J3.4 | R18.2 72.03,18.49 72.03,16.76 72.44,16.36 J3.4 | J3.4 J3.5 | R6.2 106.78,29.26 105.77,28.25 C7.2 105.66,28.14 105.46,28.14 103.73,29.87 SW0.B4 103.53,29.87 v99.87,29.87 | 92.66,25.09 92.66,27.94 92.05,28.55 92.05,29.26 R2.1 92.15,29.36 93.88,29.36 SW0.B3 v96.32,29.87
  Top 0.406: v77.93,3.66 73.56,3.66 U3.7 | v83.41,9.14 83.92,9.65 R16.2 84.03,9.79 84.12,9.89 v84.12,11.79 | LDO5.4 57.47,27.39 59.44,29.36 70.92,29.36 74.68,25.6 83.92,25.6 LDO12.4 84.15,25.09 92.66,25.09 | C3.2 24.79,29.26 23.67,28.14 | v92.66,13.01 92.66,25.09 | 122.83,28.35 v123.55,27.64 | C12.2 v47.14,5.89 | 49.32,17.88 v50.39,17.88 | C11.2 v60.76,15.34 | 45.52,16.76 45.52,14.02 47.09,14.02 C14.2 | C13.2 49.32,17.88
  Top 3.556: 35.77,21.16 LED_OUT.GND
  Bottom 0.406: v34.75,14.12 34.75,20.22 35.66,21.13 LED_IN.GND 34.65,20.32 34.14,20.83 24.28,20.83 J2.S1 | 39.93,21.13 v44.3,16.76 | 39.93,21.13 LED_OUT.GND | J1.S6 136.65,32.82 134.93,32.82 134.01,31.9 J1.S2 | J1.S1 134.01,26.82 134.93,25.91 136.65,25.91 J1.S3 136.55,25.7 v136.55,19.71 v136.55,17.58 | v83.41,9.14 v77.93,3.66 | v96.32,29.87 v99.87,29.87 99.97,29.77 106.07,29.77 v117.35,18.49 | J3.5 75.79,16.26 80.26,11.79 v84.12,11.79 92.66,11.79 v92.66,13.01 | v123.75,25.2 v123.55,27.64 122.12,28.85 U6.29 | v47.14,5.89 47.24,5.89 53.13,11.79 54.49,11.79 U4.25 | U4.25 54.25,13.01 | U4.25 55.27,14.02 51.41,17.88 v50.39,17.88 | U4.25 56.29,13.01 58.62,15.34 v60.76,15.34 | U4.25 55.27,11.89 | 39.85,21.21 39.93,21.13
  Bottom 3.556: LED_IN.GND 39.85,21.21
  other vias: 118.67,28.85 55.27,13
HOST_EN_UP  (via drill 0.35)
  Top 0.203: SWRST.A2 20.73,25.4 11.79,25.4 SWRST.A1 | Q1.C 113.79,23.88 114.3,24.38 R15.1 114.3,26.72 114.1,26.92 v113.39,26.92 | 134.11,21.23 U1.3 134.11,21.34 134.11,22.05 v132.59,23.57 | v110.13,31.7 11.18,31.7 9.14,29.67 9.14,27.84 9.75,27.23 C8.1 9.75,27.13 11.48,25.4 11.58,25.4
  Top 0.406: 11.58,25.4 11.79,25.4
  Bottom 0.203: 110.49,31.34 110.44,31.29 110.44,29.87 v113.39,26.92 | 110.49,31.34 110.85,31.7 123.75,31.7 131.88,23.57 v132.59,23.57 | 110.49,31.34 v110.13,31.7
HOST_RMII_CLK50  (via drill 0.35)
  Top 0.203: v53.54,10.46 53.75,10.46 54.36,11.07 U4.5 | v110.54,2.44 111.35,3.25 R38.2
  Bottom 0.203: v53.54,10.46 55.47,10.46 58.32,13.31 58.93,13.31 59.54,12.7 59.54,10.36 67.87,2.03 110.13,2.03 v110.54,2.44
HOST_RMII_CRS_DV  (via drill 0.35)
  Top 0.203: v61.87,10.57 62.18,10.87 62.18,11.38 R24.2 | v123.65,19.71 122.83,20.52 122.83,21.23 U1.12
  Bottom 0.203: v61.87,10.57 61.87,8.94 68.38,2.44 104.04,2.44 113.49,11.89 113.49,14 116.01,16.97 118.06,16.97 118.87,17.78 121.72,17.78 v123.65,19.71
HOST_RMII_MDC  (via drill 0.35)
  Top 0.203: v58.62,12.6 57.81,13.41 57.61,13.41 U4.13 | v124.97,2.03 126.19,2.03 126.29,1.93 133.71,1.93 135.43,3.66 135.43,4.27 U1.37
  Bottom 0.203: v58.62,12.6 58.62,10.67 67.67,1.63 124.56,1.63 v124.97,2.03
HOST_RMII_MDIO  (via drill 0.35)
  Top 0.203: U4.12 57.61,12.5 58.22,11.89 58.93,11.89 59.03,11.99 62.48,11.99 63.8,10.67 63.8,9.45 61.77,7.42 R27.1 61.77,5.28 62.28,4.78 v62.59,4.78 | v126.59,2.64 126.59,4.27 U1.30
  Bottom 0.203: v126.59,2.64 125.17,1.22 66.14,1.22 v62.59,4.78
HOST_RMII_RXD0  (via drill 0.35)
  Top 0.203: v64.11,7.72 64.11,5.18 63.4,4.47 R26.2 | v121.51,24.49 122.73,24.49 125.27,21.95 125.27,21.34 U1.10
  Bottom 0.203: v64.11,7.72 62.38,9.45 62.38,10.06 66.24,13.92 66.24,16.76 68.28,18.8 70.21,18.8 83.52,32.11 107.19,32.11 115.42,23.88 120.9,23.88 v121.51,24.49
HOST_RMII_RXD1  (via drill 0.35)
  Top 0.203: v63.09,9.75 R25.2 | v122.22,23.77 123.95,22.05 123.95,21.34 U1.11
  Bottom 0.203: v63.09,9.75 63.09,10.06 68.78,15.75 68.78,16.76 83.72,31.7 106.98,31.7 115.21,23.47 121.92,23.47 v122.22,23.77
HOST_RMII_TX_EN  (via drill 0.35)
  Top 0.203: v59.03,16.66 58.32,15.95 57.91,15.95 56.49,14.53 U4.16 | v63.7,14.73 64.11,14.73 64.72,14.12 v70.21,14.12 | v103.94,5.59 105.05,4.47 v118.06,4.47 | v129.44,5.89 130.35,4.98 130.35,4.37 U1.33
  Bottom 0.203: v59.03,16.66 61.77,16.66 v63.7,14.73 | v70.21,14.12 76.5,14.12 79.96,10.67 98.86,10.67 v103.94,5.59 | v118.06,4.47 128.02,4.47 v129.44,5.89
HOST_RMII_TXD0  (via drill 0.35)
  Top 0.203: v57.91,16.66 56.19,14.94 U4.17 | v81.28,19.61 v67.97,19.61 | v110.85,13.51 110.85,12.6 112.98,10.46 v114.71,10.46 | v126.69,7.62 127.81,6.5 127.81,4.37 U1.31
  Bottom 0.203: v57.91,16.66 60.86,19.61 v67.97,19.61 | v81.28,19.61 82.09,18.8 88.49,18.8 92.76,15.44 108.81,15.54 v110.85,13.51 | v126.69,7.62 125.07,7.62 122.22,10.46 v114.71,10.46
HOST_RMII_TXD1  (via drill 0.35)
  Top 0.203: v56.9,16.66 55.78,15.54 55.78,15.34 U4.18 | v67.16,20.32 82.09,20.32 v82.91,19.51 | v115.01,11.38 114.1,12.29 v112.27,12.29 | v127.81,7.62 132.49,7.62 134.11,5.99 134.11,4.37 U1.36
  Bottom 0.203: v56.9,16.66 60.55,20.32 v67.16,20.32 | v82.91,19.51 88.54,19.51 92.66,16.26 109.12,16.26 112.27,13.11 v112.27,12.29 | v115.01,11.38 124.05,11.38 v127.81,7.62
IO0_BOOTMODE_SW0_UP  (via drill 0.35)
  Top 0.203: C7.1 105.66,27.13 105.46,27.13 103.73,25.4 SW0.A2 103.63,25.3 v102.01,25.3 | v110.64,16.56 112.32,14.88 R14.1 112.78,14.83 115.82,11.79 v115.82,8.74 | Q2.C v108.92,20.32 | U1.25 119.41,3.5 119.41,3.49 119.38,3.45 v115.93,3.45 | v98.15,25.3 94.69,25.3 SW0.A1
  Bottom 0.203: v110.64,16.56 110.64,18.59 v108.92,20.32 103.94,25.3 v102.01,25.3 v98.15,25.3 | v115.82,8.74 115.82,3.56 v115.93,3.45
IO2_SW1_LOW
  Top 0.203: R16.1 89.87,9.75 90.89,8.74 94.22,8.74 SW1.B4 94.69,9.14 103.63,9.14 SW1.B3 103.73,9.14 105.46,10.87 105.66,10.87 | 105.66,10.87 109.42,7.11 119.18,7.11 U1.24 | 105.66,10.87 C9.2
IO4_LED1G  (via drill 0.35)
  Top 0.203: R12.1 103.56,17.27 106.91,13.01 109.54,13.01 114.6,8.03 v117.04,8.03 | v121.01,5.89 121.01,4.78 121.41,4.37 U1.26
  Bottom 0.203: v117.04,8.03 118.87,8.03 v121.01,5.89
IO5_5VIO_3A_UP
  Top 0.203: U3.5 72.24,3.66 72.24,4.37 72.54,4.67 73.76,4.67 73.97,4.47 76.4,4.47 R7.2 76.4,4.37 83.92,4.37 86.56,1.73 123.34,1.73 125.27,3.66 125.27,4.27 U1.29
IO12_3V3IO_0_LOW  (via drill 0.35)
  Top 0.203: J3.2 67.56,16.26 69.8,18.49 R18.1 71.06,18.64 71.53,19.1 74.98,19.1 v75.18,18.9 | v114.81,19.91 116.13,21.23 120.19,21.23 U1.14 | v105.97,18.49 v113.39,18.49
  Bottom 0.203: v113.39,18.49 v114.81,19.91 | v75.18,18.9 77.01,20.73 103.73,20.73 v105.97,18.49
IO13_LED1R
  Top 0.203: R13.1 104.55,18.49 105.77,17.27 119.18,17.27 U1.16
IO14_LED0B  (via drill 0.35)
  Top 0.203: v111.15,30.99 99.97,30.99 99.16,30.18 99.16,25.3 95.5,21.64 95.5,20.73 R8.1 | v119.38,24.59 119.38,24.08 121.41,22.05 121.41,21.34 U1.13
  Bottom 0.203: v111.15,30.99 117.55,24.59 v119.38,24.59
IO15_5VIO_2A_UP
  Top 0.203: 71.48,4.32 71.53,4.27 U3.4 | 71.48,4.32 70.1,5.69 69.49,5.69 68.28,4.47 66.65,4.47 R17.2 | 71.48,4.32 73.46,6.3 77.52,6.3 79.05,4.78 84.57,4.78 85.14,4.2 93.74,4.2 96.55,7.01 104.65,7.01 105.77,5.89 119.99,5.89 120.6,6.5 120.6,7.62 119.89,8.33 119.28,8.33 U1.23
IO16_LED1B  (via drill 0.35)
  Top 0.203: v112.78,8.13 108.31,12.6 105.26,12.6 105.16,12.5 100.48,12.5 95.5,17.48 R11.1 | v122.02,5.89 122.02,5.69 122.73,4.98 122.73,4.37 U1.27
  Bottom 0.203: v112.78,8.13 114.1,9.45 118.47,9.45 v122.02,5.89
IO32_5VIO_0A  (via drill 0.35)
  Top 0.203: v134.82,2.03 134.11,1.32 71.73,1.32 70.31,2.74 70.31,3.56 U3.2 | v125.07,17.48 v125.07,11.38 | v127.31,19.71 127.31,20.12 127.81,20.62 127.81,21.23 U1.8
  Bottom 0.203: v134.82,2.03 134.42,2.03 v125.07,11.38 | v127.31,19.71 v125.07,17.48
IO33_LED0G  (via drill 0.35)
  Top 0.203: v105.56,20.52 R9.1 | v112.78,15.85 115.93,15.85 v116.33,16.26 | v125.68,19.71 126.49,20.52 126.49,21.23 U1.9
  Bottom 0.203: v105.56,20.52 105.66,20.52 110.34,15.85 v112.78,15.85 | v116.33,16.26 119.99,16.26 121.01,17.27 123.24,17.27 v125.68,19.71
IO34_LED0R
  Top 0.203: R10.1 106.48,21.74 109.02,19.2 117.96,19.2 118.06,19.3 123.04,19.3 123.34,19 128.73,19 130.35,20.62 130.35,21.23 U1.6
IO35_5VIO_1A  (via drill 0.35)
  Top 0.203: v84.12,3.15 83.52,2.54 71.22,2.54 70.92,2.85 70.92,3.56 U3.3 | v117.04,15.54 116.64,15.14 v113.49,15.14 | v128.32,19.71 129.03,20.42 129.03,21.23 U1.7
  Bottom 0.203: v84.12,3.15 104.14,3.15 113.08,12.09 113.08,14.73 v113.49,15.14 | v117.04,15.54 124.16,15.54 v128.32,19.71
IO36_VSENSE  (via drill 0.35)
  Top 0.203: U1.4 132.89,19.81 v131.37,18.69 | v105.77,3.15 100.89,3.15 v99.16,4.88 | R1.1 R2.2 v91.03,26.01 | v91.03,23.88 v91.03,9.75
  Bottom 0.203: v105.77,3.15 117.75,15.14 124.32,15.14 127.88,18.69 v131.37,18.69 | v99.16,4.88 95.91,4.88 v91.03,9.75 | v91.03,26.01 v91.03,23.88
IO39_3V3IO_1_LOW  (via drill 0.35)
  Top 0.203: R19.1 71.02,13.82 71.02,15.34 70.1,16.26 J3.3 | v130.76,19.71 131.57,20.52 131.57,21.23 U1.5
  Bottom 0.203: v130.76,19.71 129.34,19.71 128.63,20.42 120.29,20.42 117.65,17.78 113.08,17.78 108.51,22.35 108.51,22.76 103.63,27.64 81.18,27.64 70.1,16.56 70.1,16.26 J3.3
N$1
  Top 0.203: R38.1 112.98,3.25 113.89,2.34 122.73,2.34 123.95,3.56 123.95,4.27 U1.28
N$2  (via drill 0.35)
  other vias: 54.25,13
N$3  (via drill 0.35)
  other vias: 55.27,11.99
N$4  (via drill 0.35)
  other vias: 56.29,13
N$5
  Top 0.203: U6.9 119.69,32.11 119.69,32.56 119.51,32.74 119.51,33.3 119.91,33.7 120.48,33.7 122.22,31.96 R5.2
N$6
  Top 0.203: R6.1 114.1,29.26 116.94,32.11 118.36,32.11 118.67,31.8 U6.11
N$7
  Top 0.203: R3.2 109.32,27.64 109.32,24.99 109.02,24.69 109.02,23.06 109.32,22.76 111.76,22.76 112.78,21.74 Q1.B
N$8
  Top 0.203: R4.2 111.66,27.64 111.66,25.6 109.93,23.88 Q2.B
N$9
  Top 0.203: R8.2 98.25,20.73 LED0.4
N$10
  Top 0.203: R9.2 100.18,20.52 100.08,20.62 LED0.3
N$11
  Top 0.203: R10.2 100.18,21.74 100.08,21.64 LED0.2
N$12  (via drill 0.35)
  Top 0.203: R22.1 30.48,8.13 30.07,8.53 J2.R8 | v50.19,15.75 50.19,14.73 50.6,14.33 51.21,14.33 51.51,14.63 53.34,14.63 53.75,14.22 U4.22
  Bottom 0.203: v50.19,15.75 51.21,15.75 51.61,15.34 51.61,14.73 45.52,8.64 30.07,8.64 J2.R8
N$13  (via drill 0.35)
  Top 0.203: R21.1 30.58,9.75 30.48,9.86 27.53,9.86 J2.R7 | v49.78,14.12 49.99,13.92 51.41,13.92 51.71,14.22 53.03,14.22 53.34,13.92 U4.23
  Bottom 0.203: v49.78,14.12 36.37,14.12 32.11,9.86 27.53,9.86 J2.R7
N$14
  Top 0.203: R11.2 98.25,17.48 LED1.4
N$15
  Top 0.203: R12.2 100.18,17.27 100.08,17.37 LED1.3
N$16
  Top 0.203: R13.2 100.18,18.49 100.08,18.39 LED1.2
N$17
  Top 0.203: J2.R2 30.07,16.15 30.38,15.85 34.65,15.85 35.87,14.63 R20.1 38.61,14.63 39.22,15.24 39.32,15.24 41.55,17.48 47.24,17.48 48.16,16.56 52.73,16.56 54.36,14.94 U4.20
N$18
  Top 0.203: R33.1 60.15,9.55 61.16,10.57 61.16,11.28 61.27,11.38 R24.1 57.91,11.38 57.2,12.09 U4.11
N$19  (via drill 0.35)
  Top 0.203: R23.1 31.8,16.26 v31.5,16.56 | v50.9,15.04 53.54,15.04 54.05,14.53 U4.21
  Bottom 0.203: J2.R1 27.53,17.48 30.58,17.48 v31.5,16.56 31.5,16.36 34.44,13.41 35.05,13.41 36.68,15.04 v50.9,15.04
N$20
  Top 0.203: U4.7 55.68,10.67 52.02,7.01 R34.1 52.02,5.28 52.63,5.28 54.15,3.76 60.35,3.76 60.76,4.17 60.76,5.18 61.27,5.69 61.27,9.75 R25.1
N$21  (via drill 0.35)
  Top 0.203: R35.1 v56.9,9.04 56.9,10.36 56.19,11.07 U4.8 | R26.1 63.4,8.43 64.21,9.25 64.21,10.87 62.38,12.7 v60.35,12.7 | v60.25,10.67 60.25,10.46 v59.03,9.25
  Bottom 0.203: v60.35,12.7 60.35,10.77 v60.25,10.67 | v59.03,9.25 58.12,9.25 57.91,9.04 v56.9,9.04
N$22
  Top 0.203: R28.2 47.14,15.75 49.48,13.41 52.93,13.41 U4.24
N$23  (via drill 0.35)
  Top 0.203: 43.33,8.89 45.82,11.38 53.34,11.38 53.75,11.79 U4.3 | 43.33,8.89 37.08,2.64 15.54,2.64 13.41,4.78 13.41,14.22 17.48,18.29 17.48,19.81 16.76,20.52 16.76,22.76 R30.1 | v41.86,10.36 40.64,11.58 R31.1 | 43.33,8.89 v42.88,9.35
  Bottom 0.203: v42.88,9.35 v41.86,10.36
N$24
  Top 0.203: R29.1 35.87,3.35 44.3,11.79 53.03,11.79 53.34,12.09 U4.2
N$25
  Top 0.203: R29.2 15.85,3.35 15.85,8.84 16.15,9.14 J2.L2
N$26
  Top 0.203: R30.2 15.85,22.76 15.85,19.71 16.15,19.41 J2.L4
N$27
  Top 0.203: U3.8 74.27,8.64 76.4,8.64 R37.2
N$28
  Top 0.203: C11.1 58.82,15.4 58.73,15.4 | R36.1 58.73,14.47 58.73,15.4 | 58.73,15.4 58.07,15.4 56.9,14.22 U4.15
N$29  (via drill 0.35)
  Top 0.203: v56.19,6.3 55.27,5.38 R32.1 | v58.32,8.43 58.32,10.26 56.79,11.79 U4.10
  Bottom 0.203: v58.32,8.43 v56.19,6.3
N$30  (via drill 0.35)
  other vias: 55.27,14.02
N$31  (via drill 0.35)
  other vias: 128.42,14.63
N$32  (via drill 0.35)
  other vias: 130.05,14.63
N$33  (via drill 0.35)
  other vias: 130.05,13
N$34  (via drill 0.35)
  other vias: 128.42,13
PHY_VDDCR
  Top 0.203: U4.6 54.76,10.67 53.03,8.94 47.14,8.94 C12.1
U0_DTR  (via drill 0.35)
  Top 0.203: R3.1 108.41,27.64 108.41,24.28 108,23.88 Q2.E 107.9,23.77 107.8,23.67 v107.8,22.45 | v121.21,18.49 125.07,18.49 125.98,17.58 135.43,17.58 137.57,19.71 137.57,22.66 135.74,24.49 134.82,24.49 133.4,25.91 131.27,25.91 130.76,26.42 120.19,26.42 U6.28
  Bottom 0.203: v121.21,18.49 118.97,18.49 117.86,17.37 112.88,17.37 v107.8,22.45
U0_RTS
  Top 0.203: R4.1 112.67,27.64 112.67,23.27 113.18,22.76 113.69,22.76 114.71,21.74 Q1.E 114.4,22.15 118.16,25.91 118.16,26.42 U6.24
U0_RXD0  (via drill 0.35)
  Top 0.203: v132.18,5.89 132.18,5.49 131.67,4.98 131.67,4.37 U1.34 | U6.26 119.18,26.42 119.18,26.01 119.18,25.91 119.18,25.74 117.32,23.88 v117.32,22.76
  Bottom 0.203: v132.18,5.89 132.18,5.94 132.87,6.63 132.87,19.2 129.71,22.35 117.73,22.35 v117.32,22.76
U0_TXD0  (via drill 0.35)
  Top 0.203: U6.25 118.67,25.81 116.64,23.77 v116.64,21.95 | v132.18,6.91 132.89,6.2 132.89,4.37 U1.35
  Bottom 0.203: v116.64,21.95 129.54,21.95 132.18,19.3 v132.18,6.91
USB_DN  (via drill 0.35)
  Top 0.203: J1.3 v131.57,29.36 | U6.5 121.11,29.36 123.55,29.36 123.75,29.16 v127.31,29.16
  Bottom 0.203: v131.57,29.36 127.51,29.36 v127.31,29.16
USB_DP  (via drill 0.35)
  Top 0.203: U6.4 123.44,28.85 123.85,28.45 v128.02,28.45 | 133.91,28.65 J1.2 134.01,28.75 135.03,28.75 v135.23,28.96
  Bottom 0.203: v135.23,28.96 132.18,28.96 131.67,28.45 v128.02,28.45
V_USB  (via drill 0.35)
  Top 0.254: v120.19,33.02 U6.8
  Top 0.406: J1.1 131.78,28.04 v129.74,30.07 | v67.56,28.55 D1.+
  Bottom 0.406: v129.74,30.07 127.2,30.07 123.85,33.02 v120.19,33.02 97.13,33.02 68.99,33.12 67.56,31.7 v67.56,28.55
VDDA  (via drill 0.35)
  Top 0.203: 42.98,5.79 42.27,5.79 FB1.2 | 42.98,5.79 C16.2 | 39.52,9.75 39.52,8.13 R22.2 39.42,8.13 38.71,7.42 v38.71,7.21 | 39.52,14.02 39.52,13.72 40.64,12.6 R31.2 40.64,12.5 | 39.52,14.02 39.52,14.63 R20.2 | 40.64,12.5 47.14,12.5 | 47.14,12.5 52.93,12.5 U4.1 | 39.52,9.75 39.52,11.38 40.64,12.5 | 39.52,9.75 R21.2 | v42.98,6.91 42.98,5.79 | J2.L1 17.78,6.71 17.78,16.76 J2.L3 | 28.75,14.94 27.53,14.94 J2.R3 | 28.75,14.94 33.73,14.94 C10.1 33.73,14.83 35.05,14.83 35.87,14.02 39.52,14.02 | 28.75,14.94 28.75,16.66 29.57,17.48 38.2,17.48 39.42,16.26 R23.2 39.52,16.26 41.15,17.88 47.45,17.88 48.36,16.97 48.77,16.97 53.14,16.97 54.76,15.34 U4.19 | C14.1 47.14,12.5
  Top 0.406: 48.77,16.97 48.91,17.11 C13.1
  Bottom 0.203: v42.98,6.91 39.01,6.91 v38.71,7.21 | J2.L3 17.78,16.76 19.1,16.76 20.93,14.94 27.43,14.94 J2.R3